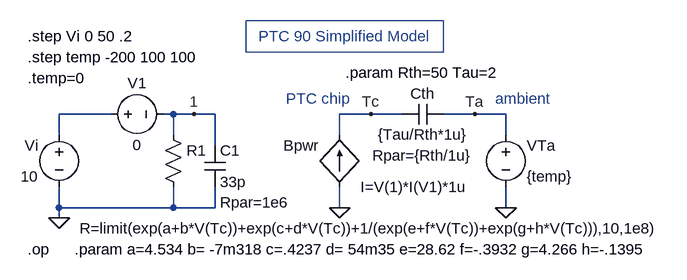
[diagram p0: schematic PTC90_Simplified_Model.asc]
PTC90_Simplified_Model.asc, the LTspice schematic file:
Version 4
SHEET 1 2228 1104
WIRE 848 96 848 64
WIRE 848 208 848 176
WIRE 848 224 848 208
WIRE 928 64 848 64
WIRE 1024 64 1008 64
WIRE 1024 96 1024 64
WIRE 1024 208 848 208
WIRE 1024 208 1024 176
WIRE 1056 64 1024 64
WIRE 1088 64 1056 64
WIRE 1088 112 1088 64
WIRE 1088 208 1024 208
WIRE 1088 208 1088 176
WIRE 1280 96 1280 64
WIRE 1280 208 1280 176
WIRE 1328 64 1280 64
WIRE 1376 64 1328 64
WIRE 1488 64 1440 64
WIRE 1536 64 1488 64
WIRE 1536 96 1536 64
WIRE 1536 208 1536 176
FLAG 1056 64 1
FLAG 1536 208 0
FLAG 1280 208 0
FLAG 1328 64 Tc
FLAG 848 224 0
FLAG 1488 64 Ta
SYMBOL voltage 848 80 M0
WINDOW 123 0 0 Left 0
WINDOW 39 0 0 Left 0
WINDOW 0 32 32 Left 0
WINDOW 3 32 80 Left 0
SYMATTR InstName Vi
SYMATTR Value 10
SYMBOL res 1008 80 R0
WINDOW 3 -128 160 Left 0
SYMATTR InstName R1
SYMATTR Value R=limit(exp(a+b*V(Tc))+exp(c+d*V(Tc))+1/(exp(e+f*V(Tc))+exp(g+h*V(Tc))),10,1e8)
SYMBOL bi 1280 176 R180
WINDOW 0 32 64 Left 0
WINDOW 3 -32 0 Right 0
SYMATTR InstName Bpwr
SYMATTR Value I=V(1)*I(V1)*1u
SYMBOL voltage 1536 80 R0
WINDOW 0 32 32 Left 0
WINDOW 3 32 80 Left 0
SYMATTR InstName VTa
SYMATTR Value {temp}
SYMBOL voltage 912 64 M90
WINDOW 0 -32 56 VBottom 0
WINDOW 3 32 56 VTop 0
SYMATTR InstName V1
SYMATTR Value 0
SYMBOL cap 1440 48 R90
WINDOW 0 0 32 VBottom 0
WINDOW 3 32 32 VTop 0
WINDOW 39 64 32 VTop 0
SYMATTR InstName Cth
SYMATTR Value {Tau/Rth*1u}
SYMATTR SpiceLine Rpar={Rth/1u}
SYMBOL cap 1072 112 R0
WINDOW 3 24 56 Left 0
WINDOW 39 24 88 Left 0
SYMATTR InstName C1
SYMATTR Value 33p
SYMATTR SpiceLine Rpar=1e6
TEXT 800 -56 Left 0 !.step Vi 0 50 .2
TEXT 1408 0 Center 0 !.param Rth=50 Tau=2
TEXT 800 -24 Left 0 !.step temp -200 100 100
TEXT 872 272 Left 0 !.param a=4.534 b= -7m318 c=.4237 d= 54m35 e=28.62 f=-.3932 g=4.266 h=-.1395
TEXT 800 272 Left 0 !.op
TEXT 800 8 Left 0 !.temp=0
TEXT 1288 -56 Center 0 ;PTC 90 Simplified Model
TEXT 1520 40 Left 0 ;ambient
TEXT 1296 40 Right 0 ;PTC chip
RECTANGLE Normal 1440 -32 1136 -80

The netlist it stands for:
* PTC90_Simplified_Model.asc
Vi N001 0 10
R1 1 0 R=limit(exp(a+b*V(Tc))+exp(c+d*V(Tc))+1/(exp(e+f*V(Tc))+exp(g+h*V(Tc))),10,1e8)
Bpwr 0 Tc I=V(1)*I(V1)*1u
VTa Ta 0 {temp}
V1 N001 1 0
Cth Ta Tc {Tau/Rth*1u} Rpar={Rth/1u}
C1 1 0 33p Rpar=1e6
.step Vi 0 50 .2
.param Rth=50 Tau=2
.step temp -200 100 100
.param a=4.534 b= -7m318 c=.4237 d= 54m35 e=28.62 f=-.3932 g=4.266 h=-.1395
.op
.temp=0
* PTC 90 Simplified Model
* ambient
* PTC chip
.backanno
.end